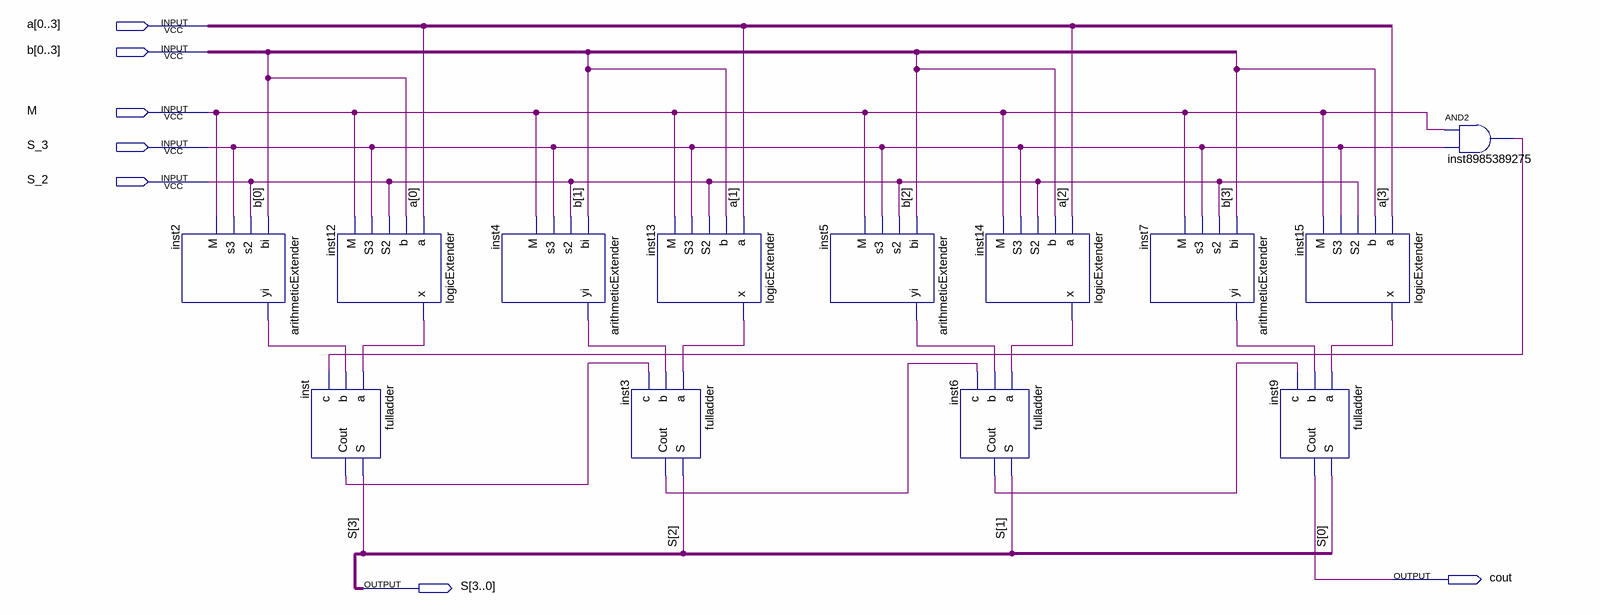
[diagram p0: schematic sheet]
// Quartus schematic alu.bdf as structural Verilog: 13 symbols, 7 pins
module alu (
  input  [0:3] a,
  input  [0:3] b,
  input  M,
  input  S_3,
  input  S_2,
  output cout,
  output [3:0] S
);

  wire inst2_yi, inst3_cout, inst4_yi, inst5_yi, inst6_cout, inst7_yi, inst12_x, inst13_x, inst14_x,
       inst15_x, inst8985389275_out, inst_cout;

  arithmeticExtender inst2 (.bi(b[0]), .s2(S_2), .s3(S_3), .M(M), .yi(inst2_yi));
  logicExtender inst12 (.a(a[0]), .b(b[0]), .S2(S_2), .S3(S_3), .M(M), .x(inst12_x));
  fulladder inst (.a(inst12_x), .b(inst2_yi), .c(inst8985389275_out), .S(S[3]), .Cout(inst_cout));
  arithmeticExtender inst4 (.bi(b[1]), .s2(S_2), .s3(S_3), .M(M), .yi(inst4_yi));
  fulladder inst3 (.a(inst13_x), .b(inst4_yi), .c(inst_cout), .S(S[2]), .Cout(inst3_cout));
  logicExtender inst13 (.a(a[1]), .b(b[1]), .S2(S_2), .S3(S_3), .M(M), .x(inst13_x));
  arithmeticExtender inst5 (.bi(b[2]), .s2(S_2), .s3(S_3), .M(M), .yi(inst5_yi));
  fulladder inst6 (.a(inst14_x), .b(inst5_yi), .c(inst3_cout), .S(S[1]), .Cout(inst6_cout));
  logicExtender inst14 (.a(a[2]), .b(b[2]), .S2(S_2), .S3(S_3), .M(M), .x(inst14_x));
  arithmeticExtender inst7 (.bi(b[3]), .s2(S_2), .s3(S_3), .M(M), .yi(inst7_yi));
  logicExtender inst15 (.a(a[3]), .b(b[3]), .S2(S_2), .S3(S_3), .M(M), .x(inst15_x));
  fulladder inst9 (.a(inst15_x), .b(inst7_yi), .c(inst6_cout), .S(S[0]), .Cout(cout));
  and inst8985389275 (inst8985389275_out, M, S_3);
endmodule
